# EAGLE design MAIN_BOARD_01 (EAGLE 9.2.2)

## Sheet 1 of 3
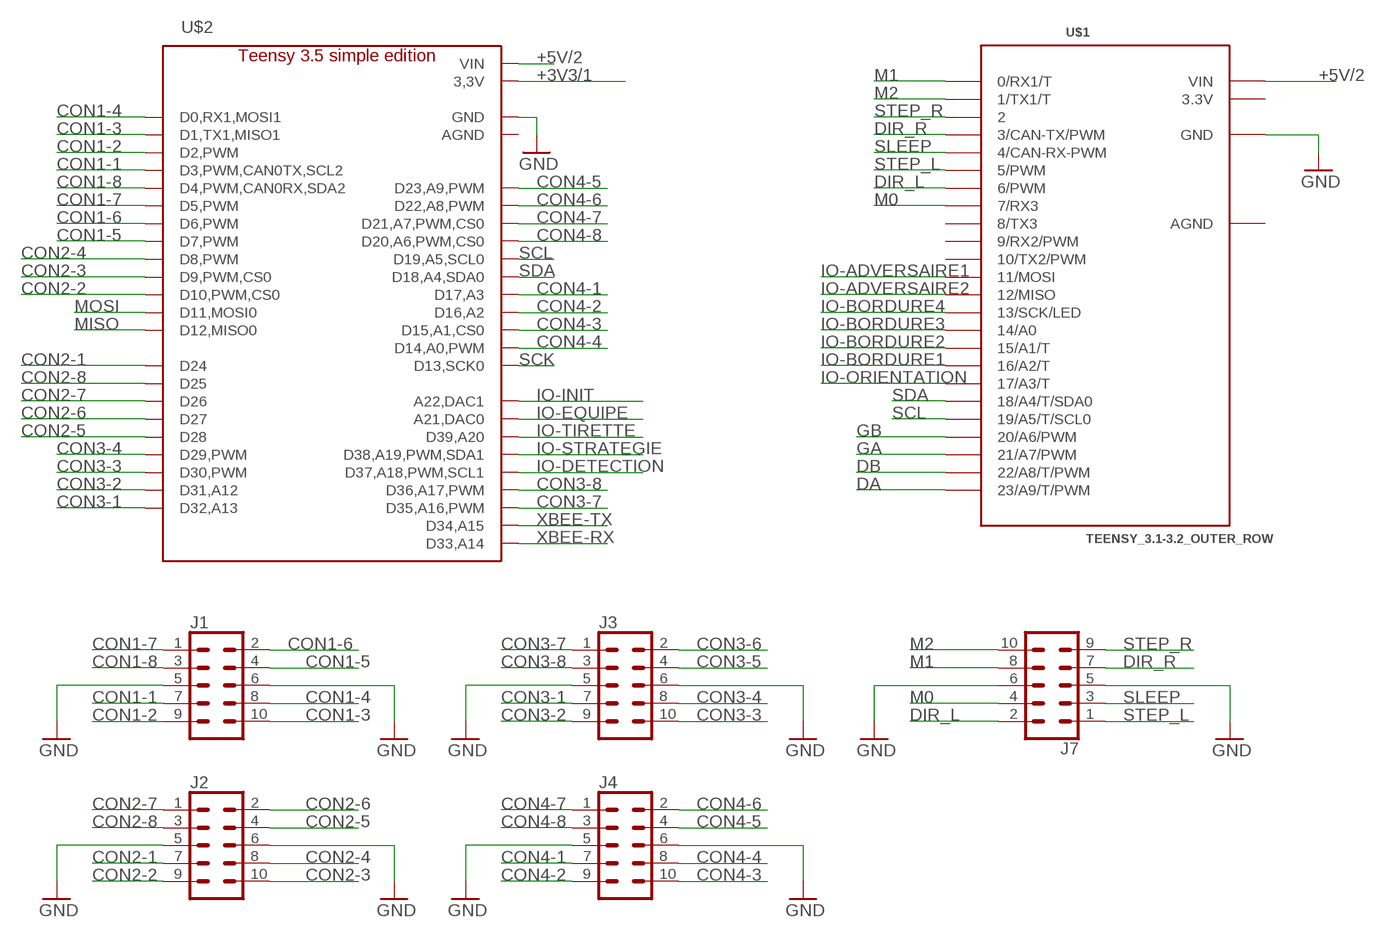
[diagram p0: schematic, sheet 1]

### Parts
J1  CONN_05X2SHD  [2X5-SHROUDED]
J2  CONN_05X2SHD  [2X5-SHROUDED]
J3  CONN_05X2SHD  [2X5-SHROUDED]
J4  CONN_05X2SHD  [2X5-SHROUDED]
J7  CONN_05X2SHD  [2X5-SHROUDED]
U$1  TEENSY_3.1-3.2_OUTER_ROW  [TEENSY_3.0-3.2&LC_OUTER_ROW]
U$2  TEENSY_3.5  [TEENSY_3.5_LIGHT]

### Nets
+3V3/1: U$2.P$15(3,3V) U$2.P$46(3,3V) ; also sheet 2
+5V/2: U$1.V_IN(VIN) U$2.P$48(VIN) ; also sheet 3
CON1-1: J1.7 U$2.P$5(D3,PWM,CAN0TX,SCL2)
CON1-2: J1.9 U$2.P$4(D2,PWM)
CON1-3: J1.10 U$2.P$3(D1,TX1,MISO1)
CON1-4: J1.8 U$2.P$2(D0,RX1,MOSI1)
CON1-5: J1.4 U$2.P$9(D7,PWM)
CON1-6: J1.2 U$2.P$8(D6,PWM)
CON1-7: J1.1 U$2.P$7(D5,PWM)
CON1-8: J1.3 U$2.P$6(D4,PWM,CAN0RX,SDA2)
CON2-1: J2.7 U$2.P$16(D24)
CON2-2: J2.9 U$2.P$12(D10,PWM,CS0)
CON2-3: J2.10 U$2.P$11(D9,PWM,CS0)
CON2-4: J2.8 U$2.P$10(D8,PWM)
CON2-5: J2.4 U$2.P$20(D28)
CON2-6: J2.2 U$2.P$19(D27)
CON2-7: J2.1 U$2.P$18(D26)
CON2-8: J2.3 U$2.P$17(D25)
CON3-1: J3.7 U$2.P$24(D32,A13)
CON3-2: J3.9 U$2.P$23(D31,A12)
CON3-3: J3.10 U$2.P$22(D30,PWM)
CON3-4: J3.8 U$2.P$21(D29,PWM)
CON3-5: J3.4
CON3-6: J3.2
CON3-7: J3.1 U$2.P$27(D35,A16,PWM)
CON3-8: J3.3 U$2.P$28(D36,A17,PWM)
CON4-1: J4.7 U$2.P$39(D17,A3)
CON4-2: J4.9 U$2.P$38(D16,A2)
CON4-3: J4.10 U$2.P$37(D15,A1,CS0)
CON4-4: J4.8 U$2.P$36(D14,A0,PWM)
CON4-5: J4.4 U$2.P$45(D23,A9,PWM)
CON4-6: J4.2 U$2.P$44(D22,A8,PWM)
CON4-7: J4.1 U$2.P$43(D21,A7,PWM,CS0)
CON4-8: J4.3 U$2.P$42(D20,A6,PWM,CS0)
DA: U$1.23/A9(23/A9/T/PWM) ; also sheet 2
DB: U$1.22/A8(22/A8/T/PWM) ; also sheet 2
DIR_L: J7.2 U$1.6(6/PWM)
DIR_R: J7.7 U$1.3(3/CAN-TX/PWM)
GA: U$1.21/A7(21/A7/PWM) ; also sheet 2
GB: U$1.20/A6(20/A6/PWM) ; also sheet 2
GND: J1.5 J1.6 J2.5 J2.6 J3.5 J3.6 J4.5 J4.6 J7.5 J7.6 U$1.GND U$2.GND U$2.P$34(GND) ; also sheet 2,3
IO-ADVERSAIRE1: U$1.11(11/MOSI) ; also sheet 2
IO-ADVERSAIRE2: U$1.12(12/MISO) ; also sheet 2
IO-BORDURE1: U$1.16/A2(16/A2/T) ; also sheet 2
IO-BORDURE2: U$1.15/A1(15/A1/T) ; also sheet 2
IO-BORDURE3: U$1.14/A0 ; also sheet 2
IO-BORDURE4: U$1.13(13/SCK/LED) ; also sheet 2
IO-DETECTION: U$2.P$29(D37,A18,PWM,SCL1) ; also sheet 2
IO-EQUIPE: U$2.P$32(A21,DAC0) ; also sheet 2
IO-INIT: U$2.P$33(A22,DAC1) ; also sheet 2
IO-ORIENTATION: U$1.17/A3(17/A3/T) ; also sheet 2
IO-STRATEGIE: U$2.P$30(D38,A19,PWM,SDA1) ; also sheet 2
IO-TIRETTE: U$2.P$31(D39,A20) ; also sheet 2
M0: J7.4 U$1.7(7/RX3)
M1: J7.8 U$1.0(0/RX1/T)
M2: J7.10 U$1.1(1/TX1/T)
MISO: U$2.P$14(D12,MISO0) ; also sheet 2
MOSI: U$2.P$13(D11,MOSI0) ; also sheet 2
SCK: U$2.P$35(D13,SCK0) ; also sheet 2
SCL: U$1.19/A5(19/A5/T/SCL0) U$2.P$41(D19,A5,SCL0) ; also sheet 2
SDA: U$1.18/A4(18/A4/T/SDA0) U$2.P$40(D18,A4,SDA0) ; also sheet 2
SLEEP: J7.3 U$1.4(4/CAN-RX-PWM)
STEP_L: J7.1 U$1.5(5/PWM)
STEP_R: J7.9 U$1.2
XBEE-RX: U$2.P$25(D33,A14) ; also sheet 2
XBEE-TX: U$2.P$26(D34,A15) ; also sheet 2
Unconnected: U$1.8(8/TX3) U$1.9(9/RX2/PWM) U$1.10(10/TX2/PWM) U$2.P$47(AGND)

## Sheet 2 of 3
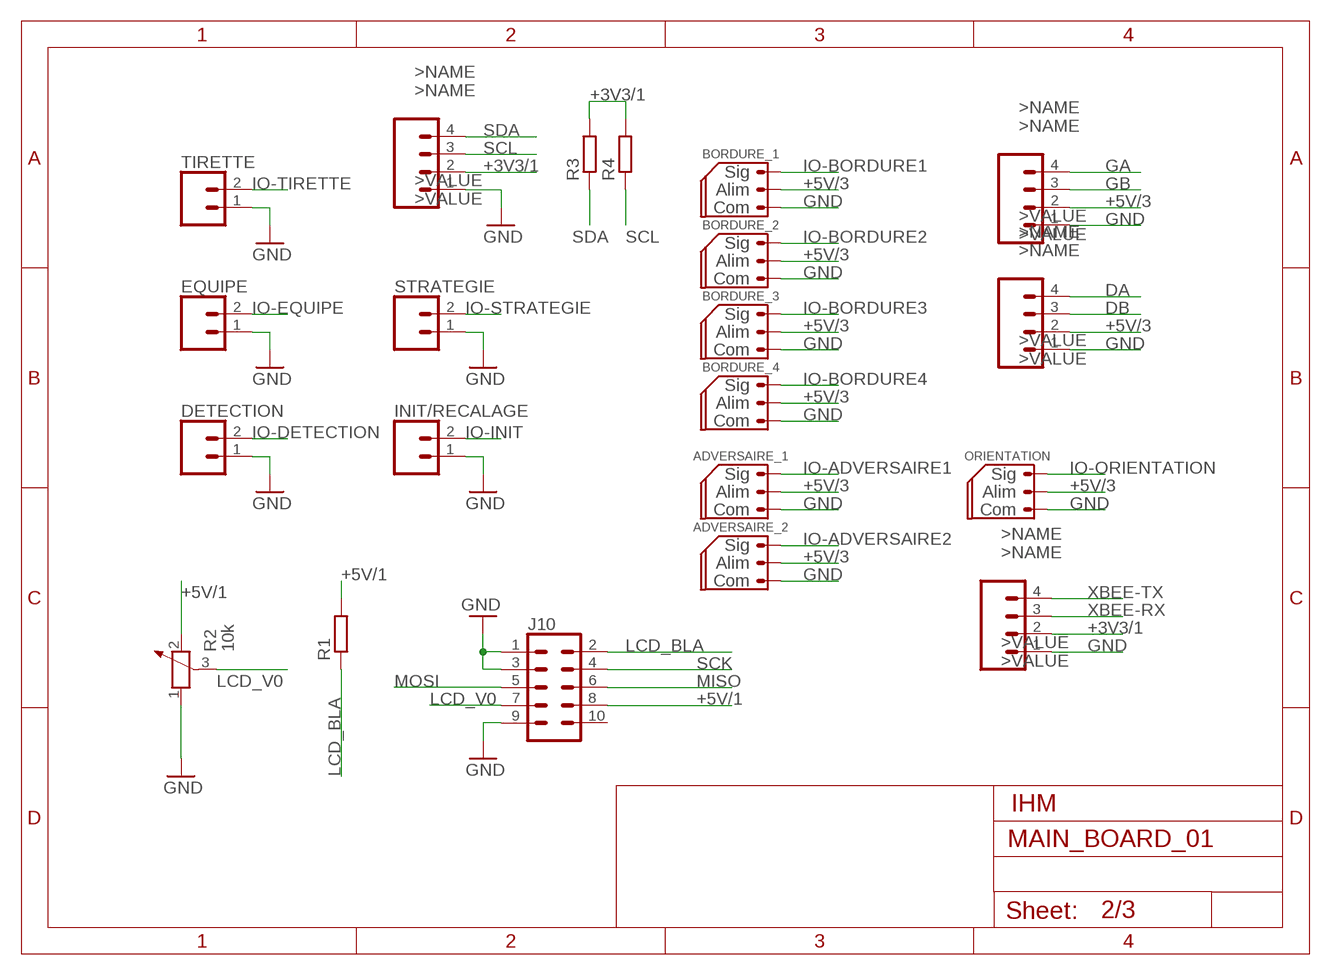
[diagram p1: schematic, sheet 2]

### Parts
ADVERSAIRE_1  CONN_03_SERVO  [MOLEX-1X3]
ADVERSAIRE_2  CONN_03_SERVO  [MOLEX-1X3]
BORDURE_1  CONN_03_SERVO  [MOLEX-1X3]
BORDURE_2  CONN_03_SERVO  [MOLEX-1X3]
BORDURE_3  CONN_03_SERVO  [MOLEX-1X3]
BORDURE_4  CONN_03_SERVO  [MOLEX-1X3]
COM-I2C  CONN_04POLAR  [MOLEX-1X4]
COM-XBEE  CONN_04POLAR  [MOLEX-1X4]
DETECTION  CONN_02POLAR  [MOLEX-1X2]
ENC_DROIT  CONN_04POLAR  [MOLEX-1X4]
ENC_GAUCHE  CONN_04POLAR  [MOLEX-1X4]
EQUIPE  CONN_02POLAR  [MOLEX-1X2]
INIT/RECALAGE  CONN_02POLAR  [MOLEX-1X2]
J10  CONN_05X2SHD  [2X5-SHROUDED]
ORIENTATION  CONN_03_SERVO  [MOLEX-1X3]
R1  R-EU_R1206  [R1206]
R2  10k  POTENTIOMETER_PT-10  [PT-10]
R3  R-EU_R1206  [R1206]
R4  R-EU_R1206  [R1206]
STRATEGIE  CONN_02POLAR  [MOLEX-1X2]
TIRETTE  CONN_02POLAR  [MOLEX-1X2]

### Nets
+3V3/1: COM-I2C.2 COM-XBEE.2 R3.2 R4.2 ; also sheet 1
+5V/1: J10.8 R1.2 R2.2 ; also sheet 3
+5V/3: ADVERSAIRE_1.2 ADVERSAIRE_2.2 BORDURE_1.2 BORDURE_2.2 BORDURE_3.2 BORDURE_4.2 ENC_DROIT.2 ENC_GAUCHE.2 ORIENTATION.2 ; also sheet 3
DA: ENC_DROIT.4 ; also sheet 1
DB: ENC_DROIT.3 ; also sheet 1
GA: ENC_GAUCHE.4 ; also sheet 1
GB: ENC_GAUCHE.3 ; also sheet 1
GND: ADVERSAIRE_1.1 ADVERSAIRE_2.1 BORDURE_1.1 BORDURE_2.1 BORDURE_3.1 BORDURE_4.1 COM-I2C.1 COM-XBEE.1 DETECTION.1 ENC_DROIT.1 ENC_GAUCHE.1 EQUIPE.1 INIT/RECALAGE.1 J10.1 J10.3 J10.9 ORIENTATION.1 R2.1 STRATEGIE.1 TIRETTE.1 ; also sheet 1,3
IO-ADVERSAIRE1: ADVERSAIRE_1.3 ; also sheet 1
IO-ADVERSAIRE2: ADVERSAIRE_2.3 ; also sheet 1
IO-BORDURE1: BORDURE_1.3 ; also sheet 1
IO-BORDURE2: BORDURE_2.3 ; also sheet 1
IO-BORDURE3: BORDURE_3.3 ; also sheet 1
IO-BORDURE4: BORDURE_4.3 ; also sheet 1
IO-DETECTION: DETECTION.2 ; also sheet 1
IO-EQUIPE: EQUIPE.2 ; also sheet 1
IO-INIT: INIT/RECALAGE.2 ; also sheet 1
IO-ORIENTATION: ORIENTATION.3 ; also sheet 1
IO-STRATEGIE: STRATEGIE.2 ; also sheet 1
IO-TIRETTE: TIRETTE.2 ; also sheet 1
LCD_BLA: J10.2 R1.1
LCD_V0: J10.7 R2.3
MISO: J10.6 ; also sheet 1
MOSI: J10.5 ; also sheet 1
SCK: J10.4 ; also sheet 1
SCL: COM-I2C.3 R4.1 ; also sheet 1
SDA: COM-I2C.4 R3.1 ; also sheet 1
XBEE-RX: COM-XBEE.3 ; also sheet 1
XBEE-TX: COM-XBEE.4 ; also sheet 1
Unconnected: J10.10

### Notes on the sheet
- IHM

## Sheet 3 of 3
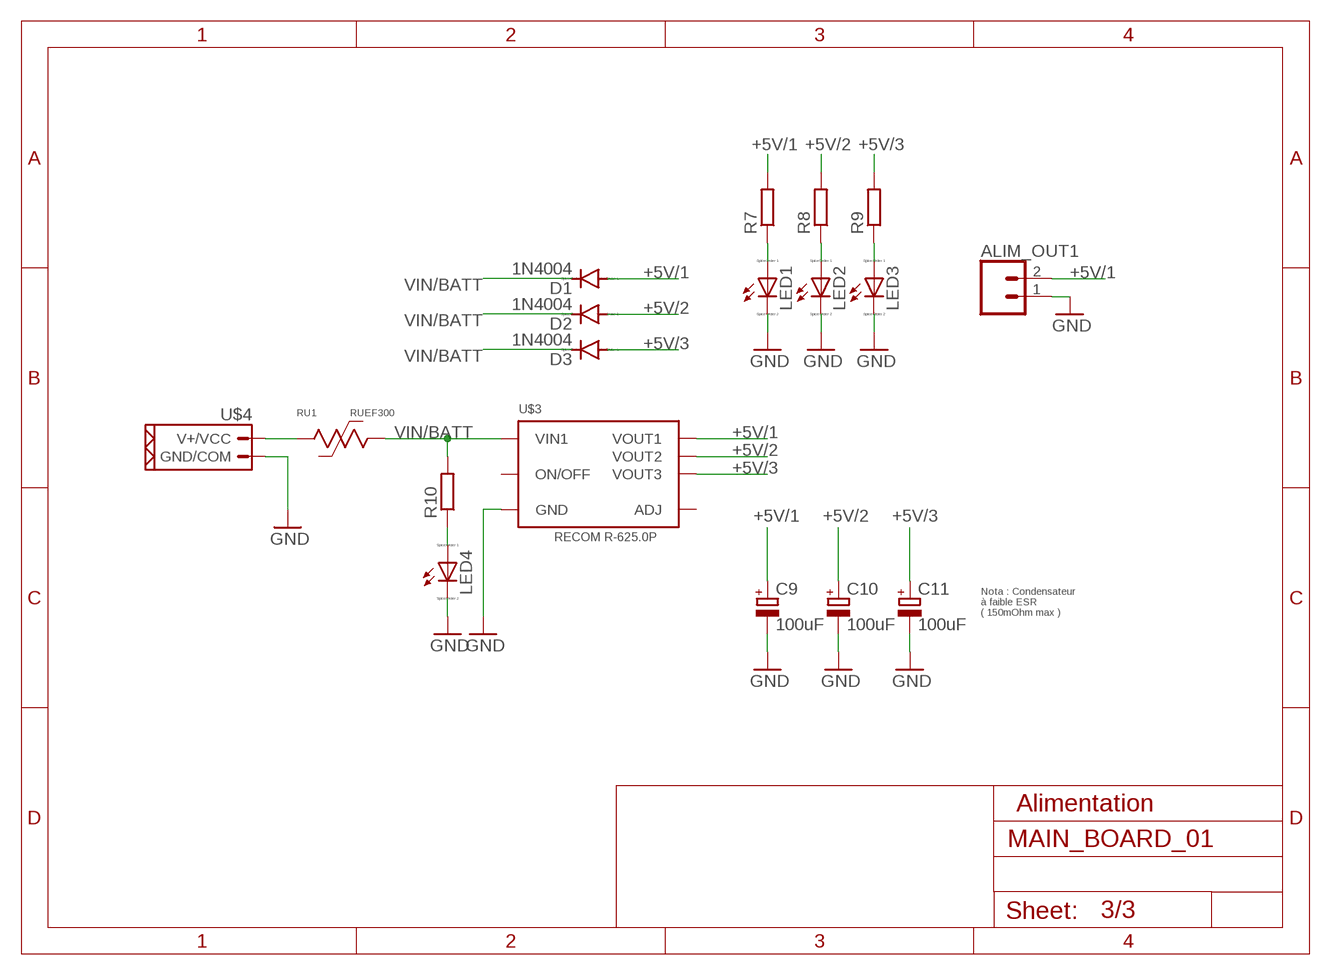
[diagram p2: schematic, sheet 3]

### Parts
ALIM_OUT1  CONN_02POLAR  [MOLEX-1X2]
C9  100uF  CPOL-EUE5-10.5  [E5-10,5]
C10  100uF  CPOL-EUE5-10.5  [E5-10,5]
C11  100uF  CPOL-EUE5-10.5  [E5-10,5]
D1  1N4004  [DO41-10]
D2  1N4004  [DO41-10]
D3  1N4004  [DO41-10]
LED1  LED_E  [LED_1206]
LED2  LED_E  [LED_1206]
LED3  LED_E  [LED_1206]
LED4  LED_E  [LED_1206]
R7  R-EU_R1206  [R1206]
R8  R-EU_R1206  [R1206]
R9  R-EU_R1206  [R1206]
R10  R-EU_R1206  [R1206]
RU1  RUEF300  [RUEF300]
U$3  R-625.0P  [R-6XXXP]
U$4  CONN_02_PUI  [NSK396-2C]

### Nets
+5V/1: ALIM_OUT1.2 C9.+ D1.A R7.2 U$3.P$9(VOUT1) ; also sheet 2
+5V/2: C10.+ D2.A R8.2 U$3.P$10(VOUT2) ; also sheet 1
+5V/3: C11.+ D3.A R9.2 U$3.P$11(VOUT3) ; also sheet 2
GND: ALIM_OUT1.1 C9.- C10.- C11.- LED1.C LED2.C LED3.C LED4.C U$3.P$5(GND) U$3.P$6(GND) U$3.P$7(GND) U$3.P$8(GND) U$4.P$1(GND/COM) ; also sheet 1,2
N$2: LED1.A R7.1
N$3: LED4.A R10.1
N$4: RU1.P$1 U$4.P$2(V+/VCC)
N$5: LED2.A R8.1
N$6: LED3.A R9.1
VIN/BATT: D1.C D2.C D3.C R10.2 RU1.P$2 U$3.P$2(VIN1) U$3.P$3(VIN1) U$3.P$4(VIN1)
Unconnected: U$3.P$1(ON/OFF)

### Notes on the sheet
- Nota : Condensateur
  à faible ESR 
  ( 150mOhm max )
- Alimentation

## Power pins joined to a net without a drawn wire
3.3V: U$1.3.3V
ADJ: U$3.P$12(ADJ)
AGND: U$1.AGND

## Library data of the parts
ADVERSAIRE_1 ADVERSAIRE_2 BORDURE_1-BORDURE_4 ORIENTATION = OPENBOT:CONN_03_SERVO
ALIM_OUT1 DETECTION EQUIPE INIT/RECALAGE STRATEGIE TIRETTE = OPENBOT:CONN_02: Multi connection point. Often used as Generic Header-pin footprint for 0.1 inch spaced/style header connections On any of the 0.1 inch spaced packages, you can populate with these: Break Away Headers - Straight <https://www.sparkfun.com/products/116> (PRT-00116) Break Away Male Headers - Right Angle <https://www.sparkfun.com/products/553> (PRT-00553) Female Headers <https://www.sparkfun.com/products/115> (PRT-00115) Break Away Headers - Machine Pin <https://www.sparkfun.com/products/117> (PRT-00117) Break Away Female Headers - Swiss Machine Pin <https://www.sparkfun.com/products/743> (PRT-00743) For SCREWTERMINALS and SPRING TERMINALS visit here: Screw Terimnals on SparkFun.com <https://www.sparkfun.com/search/results?term=Screw+Terminals> (5mm/3.5mm/2.54mm spacing) This device is also useful as a general connection point to wire up your design to another part of your project. Our various solder wires solder well into these plated through hole pads. Hook-Up Wire - Assortment (Stranded, 22 AWG) <https://www.sparkfun.com/products/11375> (PRT-11375) Hook-Up Wire - Assortment (Solid Core, 22 AWG) <https://www.sparkfun.com/products/11367> (PRT-11367) View the entire wire category on our website here <https://www.sparkfun.com/categories/141> Special notes: Molex polarized connector foot print use with: PRT-08233 with associated crimp pins and housings. 2.54_SCREWTERM for use with PRT-10571. 3.5mm Screw Terminal footprints for PRT-08084 5mm Screw Terminal footprints for use with PRT-08432 Multi connection point. Often used as Generic Header-pin footprint for 0.1 inch spaced/style header connections On any of the 0.1 inch spaced packages, you can populate with these: Break Away Headers - Straight <https://www.sparkfun.com/products/116> (PRT-00116) Break Away Male Headers - Right Angle <https://www.sparkfun.com/products/553> (PRT-00553) Female Headers <https://www.sparkfun.com/products/115> (PRT-00115) Break Away Headers - Machine Pin <https://www.sparkfun.com/products/117> (PRT-00117) Break Away Female Headers - Swiss Machine Pin <https://www.sparkfun.com/products/743> (PRT-00743) For SCREWTERMINALS and SPRING TERMINALS visit here: Screw Terimnals on SparkFun.com <https://www.sparkfun.com/search/results?term=Screw+Terminals> (5mm/3.5mm/2.54mm spacing) This device is also useful as a general connection point to wire up your design to another part of your project. Our various solder wires solder well into these plated through hole pads. Hook-Up Wire - Assortment (Stranded, 22 AWG) <https://www.sparkfun.com/products/11375> (PRT-11375) Hook-Up Wire - Assortment (Solid Core, 22 AWG) <https://www.sparkfun.com/products/11367> (PRT-11367) View the entire wire category on our website here <https://www.sparkfun.com/categories/141> Special notes: Molex polarized connector foot print use with: PRT-08233 with associated crimp pins and housings. 2.54_SCREWTERM for use with PRT-10571. 3.5mm Screw Terminal footprints for PRT-08084 5mm Screw Terminal footprints for use with PRT-08432; SF_ID: PRT-09918
C9-C11 = rcl:CPOL-EU: POLARIZED CAPACITOR, European symbol; SPICEPREFIX: C
COM-I2C COM-XBEE ENC_DROIT ENC_GAUCHE = OPENBOT:CONN_04: Multi connection point. Often used as Generic Header-pin footprint for 0.1 inch spaced/style header connections On any of the 0.1 inch spaced packages, you can populate with these: Break Away Headers - Straight <https://www.sparkfun.com/products/116> (PRT-00116) Break Away Male Headers - Right Angle <https://www.sparkfun.com/products/553> (PRT-00553) Female Headers <https://www.sparkfun.com/products/115> (PRT-00115) Break Away Headers - Machine Pin <https://www.sparkfun.com/products/117> (PRT-00117) Break Away Female Headers - Swiss Machine Pin <https://www.sparkfun.com/products/743> (PRT-00743) For SCREWTERMINALS and SPRING TERMINALS visit here: Screw Terimnals on SparkFun.com <https://www.sparkfun.com/search/results?term=Screw+Terminals> (5mm/3.5mm/2.54mm spacing) This device is also useful as a general connection point to wire up your design to another part of your project. Our various solder wires solder well into these plated through hole pads. Hook-Up Wire - Assortment (Stranded, 22 AWG) <https://www.sparkfun.com/products/11375> (PRT-11375) Hook-Up Wire - Assortment (Solid Core, 22 AWG) <https://www.sparkfun.com/products/11367> (PRT-11367) View the entire wire category on our website here <https://www.sparkfun.com/categories/141> Special notes: Molex polarized connector foot print use with SKU : PRT-08231 with associated crimp pins and housings. 1MM SMD Version SKU: PRT-10208 Multi connection point. Often used as Generic Header-pin footprint for 0.1 inch spaced/style header connections On any of the 0.1 inch spaced packages, you can populate with these: Break Away Headers - Straight <https://www.sparkfun.com/products/116> (PRT-00116) Break Away Male Headers - Right Angle <https://www.sparkfun.com/products/553> (PRT-00553) Female Headers <https://www.sparkfun.com/products/115> (PRT-00115) Break Away Headers - Machine Pin <https://www.sparkfun.com/products/117> (PRT-00117) Break Away Female Headers - Swiss Machine Pin <https://www.sparkfun.com/products/743> (PRT-00743) For SCREWTERMINALS and SPRING TERMINALS visit here: Screw Terimnals on SparkFun.com <https://www.sparkfun.com/search/results?term=Screw+Terminals> (5mm/3.5mm/2.54mm spacing) This device is also useful as a general connection point to wire up your design to another part of your project. Our various solder wires solder well into these plated through hole pads. Hook-Up Wire - Assortment (Stranded, 22 AWG) <https://www.sparkfun.com/products/11375> (PRT-11375) Hook-Up Wire - Assortment (Solid Core, 22 AWG) <https://www.sparkfun.com/products/11367> (PRT-11367) View the entire wire category on our website here <https://www.sparkfun.com/categories/141> Special notes: Molex polarized connector foot print use with SKU : PRT-08231 with associated crimp pins and housings. 1MM SMD Version SKU: PRT-10208; PROD_ID: CONN-08186; SF_ID: PRT-08231
D1-D3 = diode:1N4004: DIODE general purpose rectifier, 1 A
J1-J4 J7 J10 = OPENBOT:CONN_05X2: Multi connection point. Often used as Generic Header-pin footprint for 0.1 inch spaced/style header connections For AVR SPI programming port, see special device with nice symbol: "AVR_SPI_PROG_5x2.dev" You can populate with any combo of single row headers, but if you'd like an exact match, check these: 2x5 AVR ICSP Male Header <https://www.sparkfun.com/products/778> (PRT-00778) 2x5 Pin Shrouded Header <https://www.sparkfun.com/products/8506> (PRT-08506) On any of the 0.1 inch spaced packages, you can populate with these: Break Away Headers - Straight <https://www.sparkfun.com/products/116> (PRT-00116) Break Away Male Headers - Right Angle <https://www.sparkfun.com/products/553> (PRT-00553) Female Headers <https://www.sparkfun.com/products/115> (PRT-00115) Break Away Headers - Machine Pin <https://www.sparkfun.com/products/117> (PRT-00117) Break Away Female Headers - Swiss Machine Pin <https://www.sparkfun.com/products/743> (PRT-00743) Special note: the shrouded connector mates well with our 5x2 ribbon cables: 2x5 Pin IDC Ribbon Cable <https://www.sparkfun.com/products/8535> (PRT-08535); PROD_ID: CONN-08671; SF_ID: PRT-08506
LED1-LED4 = eagle-ltspice:LED_E: LED Source: http://www.osram.convergy.de Source: www.luxeon.com Source: www.kingbright.com; SPICEMODEL: NONE; SPICEPREFIX: D; SPICETYPE: diode
R1 R3 R4 R7-R10 = rcl:R-EU_: RESISTOR, European symbol; SPICEPREFIX: R
R2 = rcl:POTENTIOMETER_: Potentiometer
RU1 = OPENBOT:RUEF300
U$1 = OPENBOT:TEENSY_3.1-3.2_OUTER_ROW: Footprint for Teensy 3.1 or 3.2 board using all pin connections on the outer perimeter
U$2 = KARIBOUS:TEENSY_3.5
U$3 = KARIBOUS:R-625.0P
U$4 = OPENBOT:CONN_02_PUI

## Board
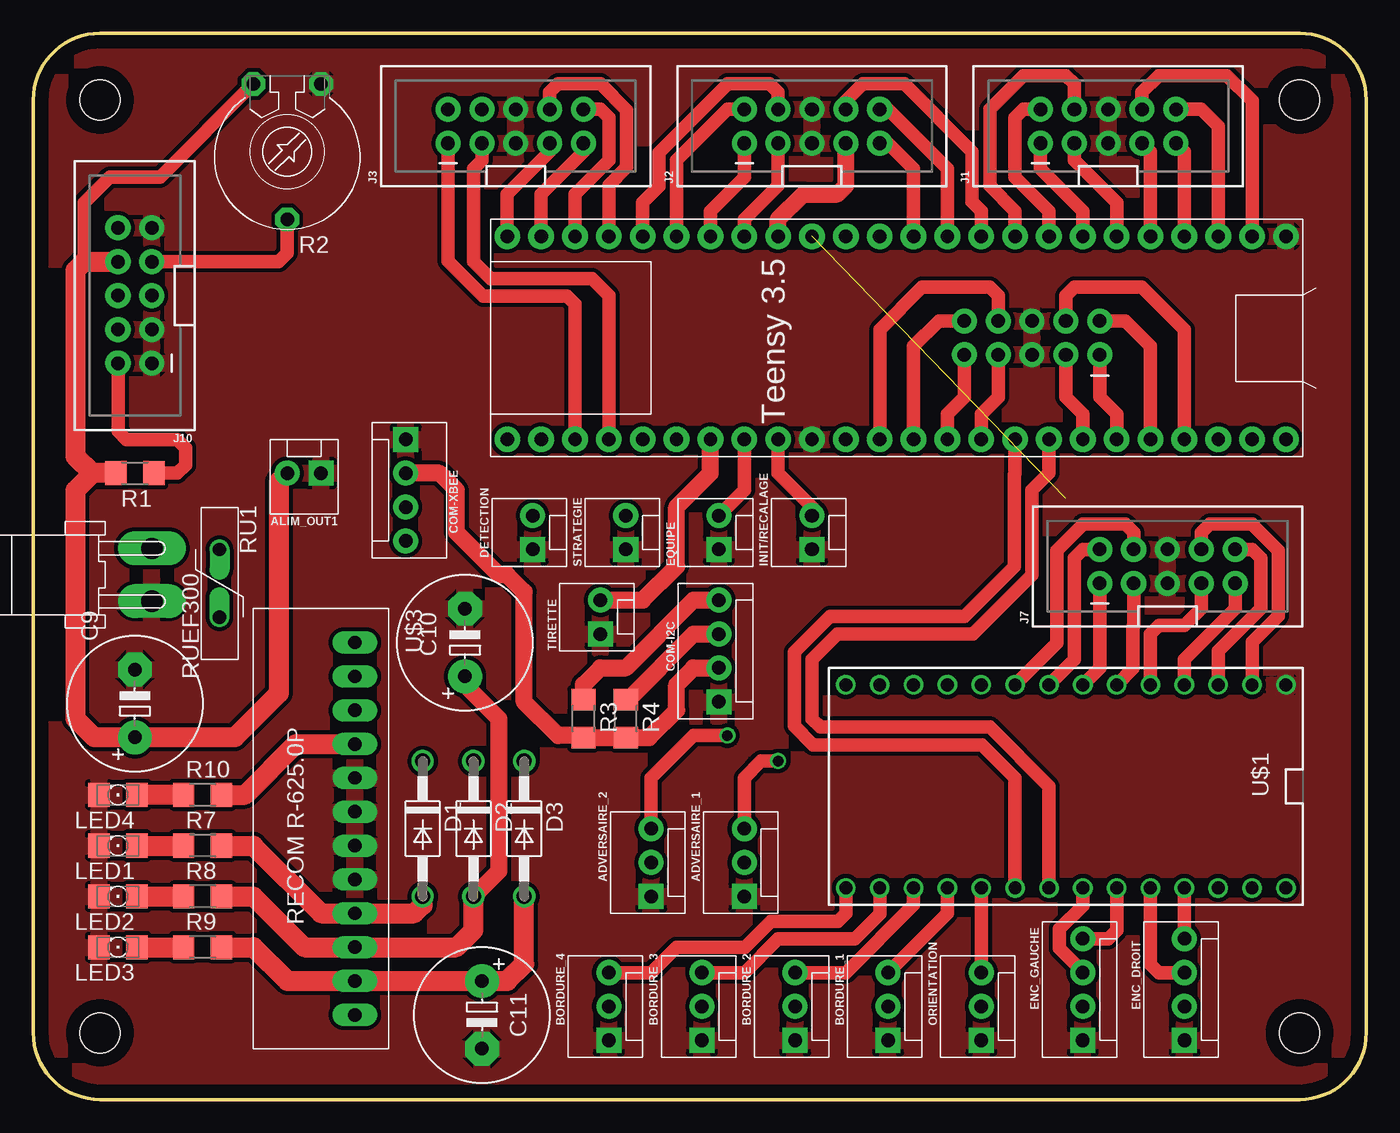
[diagram p3: board, top side]
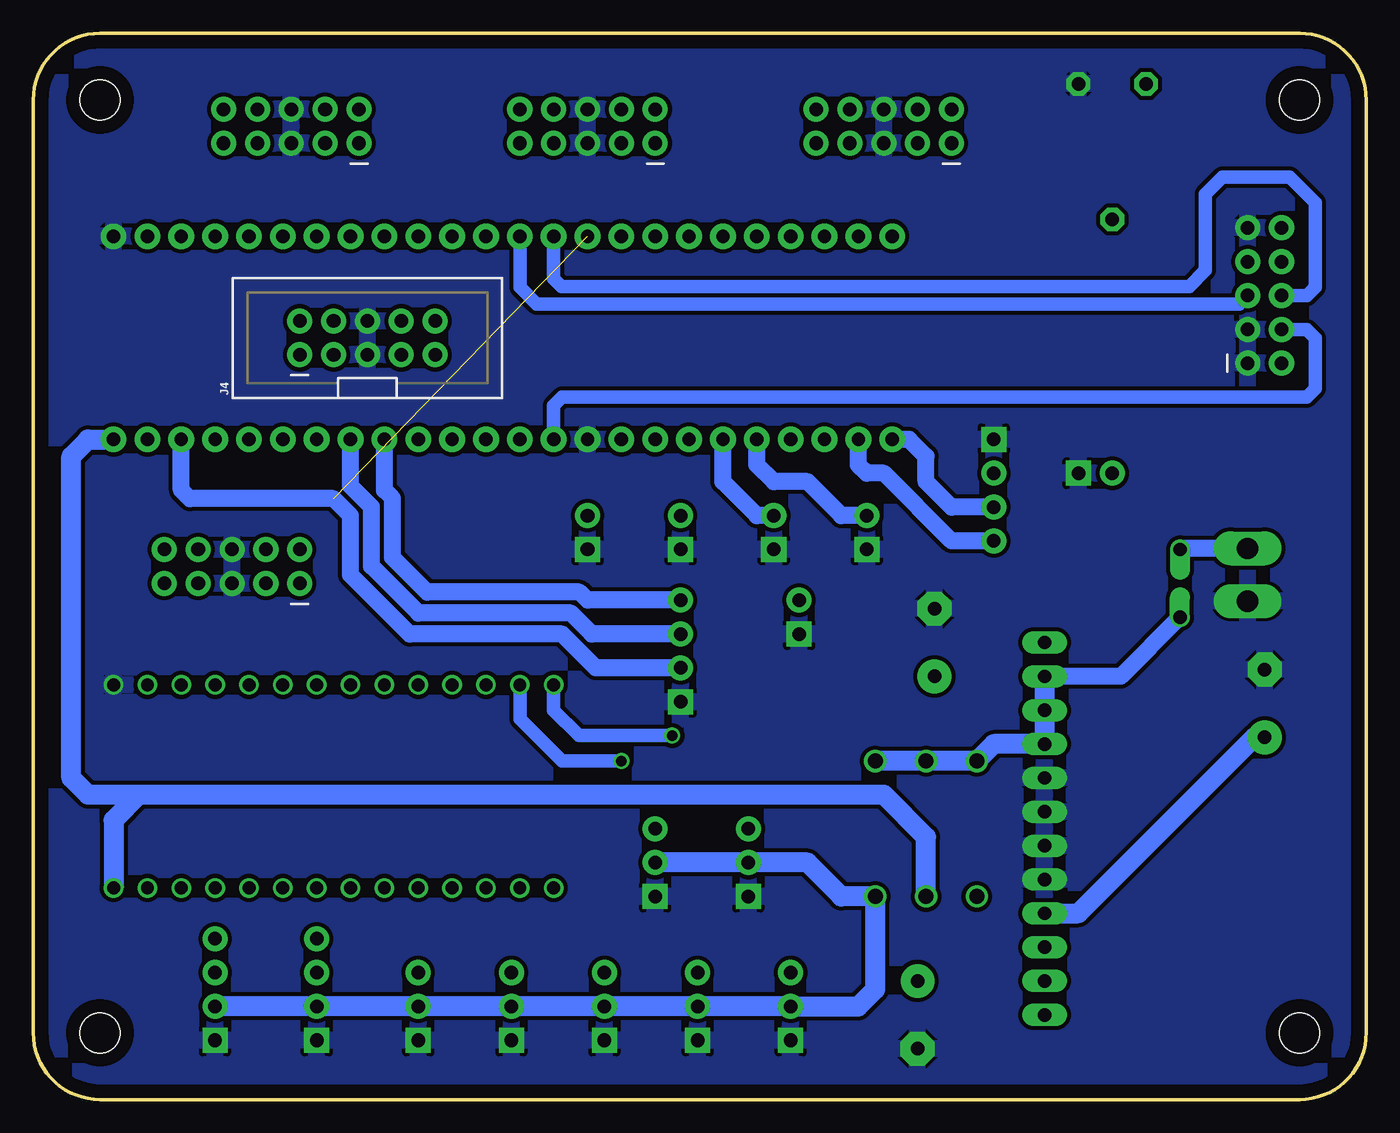
[diagram p4: board, bottom side, seen from below]

Size 100 x 80 mm. Coordinates in mm from the lower left corner, seen from the top.
Outline: 95,0 arc90 100,5 100,75 arc90 95,80 5,80 arc90 0,75 0,5 arc90 5,0 95,0
Copper layers (1*16): Top 0.035mm / dielectric 1.5mm / Bottom 0.035mm
Design rules "default *": minimum track width 6mil, minimum drill 0.35mm, track to track 12mil, track to pad 12mil, pad to pad 6mil, via to via 6mil, smd to smd 6mil, copper to edge 40mil, drill to drill 6mil, minimum pad ring 10mil, minimum via ring 8mil, stop-mask expansion 4mil, vias tented up to drill 0mil, thermal gap 10mil
Holes 3 mm at 95,75 95,5 5,75 5,5

### Footprints (pad centres in the part's own frame; a part is rotated, then mirrored left to right if it is on the bottom)
MOLEX-1X3 = drill 1.016 pad 1.88 square: 1 0,0 | drill 1.016 pad 1.88: 2 2.54,0; 3 5.08,0
MOLEX-1X2 = drill 1.016 pad 1.88 square: 1 0,0 | drill 1.016 pad 1.88: 2 2.54,0
E5-10,5 = drill 1.016 pad 2.54: + -2.54,0 | drill 1.016 pad 2.54 octagon: - 2.54,0
MOLEX-1X4 = drill 1.016 pad 1.88 square: 1 0,0 | drill 1.016 pad 1.88: 2 2.54,0; 3 5.08,0; 4 7.62,0
DO41-10 = drill 1.118: A 5.08,0; C -5.08,0
2X5-SHROUDED = drill 1.016 pad 1.88: 1 -1.27,5.08; 2 1.27,5.08; 3 -1.27,2.54; 4 1.27,2.54; 5 -1.27,0; 6 1.27,0; 7 -1.27,-2.54; 8 1.27,-2.54; 9 -1.27,-5.08; 10 1.27,-5.08
LED_1206 = smd 1.6 x 1.803: A -1.422,0; C 1.422,0
R1206 = smd 1.6 x 1.803: 1 -1.422,0; 2 1.422,0
PT-10 = drill 1.016 pad 1.778 octagon: 1 -2.54,-5.08; 2 2.54,-5.08; 3 0,5.08
RUEF300 = drill 1 offset: P$1 -2.54,0; P$2 2.54,0
TEENSY_3.0-3.2&LC_OUTER_ROW = drill 0.965: 0 -7.62,13.97; 1 -7.62,11.43; 2 -7.62,8.89; 3 -7.62,6.35; 3.3V 7.62,11.43; 4 -7.62,3.81; 5 -7.62,1.27; 6 -7.62,-1.27; 7 -7.62,-3.81; 8 -7.62,-6.35; 9 -7.62,-8.89; 10 -7.62,-11.43; 11 -7.62,-13.97; 12 -7.62,-16.51; 13 7.62,-16.51; 14/A0 7.62,-13.97; 15/A1 7.62,-11.43; 16/A2 7.62,-8.89; 17/A3 7.62,-6.35; 18/A4 7.62,-3.81; 19/A5 7.62,-1.27; 20/A6 7.62,1.27; 21/A7 7.62,3.81; 22/A8 7.62,6.35; 23/A9 7.62,8.89; AGND 7.62,13.97; GND -7.62,16.51; V_IN 7.62,16.51
TEENSY_3.5_LIGHT = drill 1 pad 1.93: GND -7.62,0; P$2 -7.62,-2.54; P$3 -7.62,-5.08; P$4 -7.62,-7.62; P$5 -7.62,-10.16; P$6 -7.62,-12.7; P$7 -7.62,-15.24; P$8 -7.62,-17.78; P$9 -7.62,-20.32; P$10 -7.62,-22.86; P$11 -7.62,-25.4; P$12 -7.62,-27.94; P$13 -7.62,-30.48; P$14 -7.62,-33.02; P$15 -7.62,-35.56; P$16 -7.62,-38.1; P$17 -7.62,-40.64; P$18 -7.62,-43.18; P$19 -7.62,-45.72; P$20 -7.62,-48.26; P$21 -7.62,-50.8; P$22 -7.62,-53.34; P$23 -7.62,-55.88; P$24 -7.62,-58.42; P$25 7.62,-58.42; P$26 7.62,-55.88; P$27 7.62,-53.34; P$28 7.62,-50.8; P$29 7.62,-48.26; P$30 7.62,-45.72; P$31 7.62,-43.18; P$32 7.62,-40.64; P$33 7.62,-38.1; P$34 7.62,-35.56; P$35 7.62,-33.02; P$36 7.62,-30.48; P$37 7.62,-27.94; P$38 7.62,-25.4; P$39 7.62,-22.86; P$40 7.62,-20.32; P$41 7.62,-17.78; P$42 7.62,-15.24; P$43 7.62,-12.7; P$44 7.62,-10.16; P$45 7.62,-7.62; P$46 7.62,-5.08; P$47 7.62,-2.54; P$48 7.62,0
R-6XXXP = drill 1 pad 1.676 long: P$1 0,0; P$2 2.54,0; P$3 5.08,0; P$4 7.62,0; P$5 10.16,0; P$6 12.7,0; P$7 15.24,0; P$8 17.78,0; P$9 20.32,0; P$10 22.86,0; P$11 25.4,0; P$12 27.94,0
NSK396-2C = drill 1.6 pad 2.54 long: P$1 -1.98,0; P$2 1.98,0

### Placement (x,y rotation side)
ADVERSAIRE_1  53.34,15.24 90 top
ADVERSAIRE_2  46.35,15.24 90 top
ALIM_OUT1  21.59,46.99 180 top
BORDURE_1  64.14,4.45 90 top
BORDURE_2  57.15,4.45 90 top
BORDURE_3  50.16,4.45 90 top
BORDURE_4  43.18,4.45 90 top
C9  7.62,29.72 90 top
C10  32.38,34.29 90 top
C11  33.66,6.35 270 top
COM-I2C  51.44,29.84 90 top
COM-XBEE  27.94,49.53 270 top
D1  29.21,20.32 270 top
D2  33.02,20.32 270 top
D3  36.83,20.32 270 top
DETECTION  37.47,41.27 90 top
ENC_DROIT  86.36,4.45 90 top
ENC_GAUCHE  78.74,4.45 90 top
EQUIPE  51.44,41.27 90 top
INIT/RECALAGE  58.42,41.27 90 top
J1  80.64,73.03 90 top
J2  58.42,73.03 90 top
J3  36.2,73.03 90 top
J4  74.93,57.15 90 bottom
J7  85.09,40.01 90 top
J10  7.62,60.33 180 top
LED1  6.35,19.05 180 top
LED2  6.35,15.24 180 top
LED3  6.35,11.43 180 top
LED4  6.35,22.86 180 top
ORIENTATION  71.12,4.45 90 top
R1  7.62,46.99 180 top
R2  19.05,71.12 180 top
R3  41.27,28.57 270 top
R4  44.45,28.57 270 top
R7  12.7,19.05 0 top
R8  12.7,15.24 0 top
R9  12.7,11.43 0 top
R10  12.7,22.86 0 top
RU1  13.97,38.73 270 top
STRATEGIE  44.45,41.27 90 top
TIRETTE  42.55,34.92 90 top
U$1  77.47,23.5 270 top
U$2  93.98,57.15 270 top
U$3  24.13,34.29 270 top
U$4  8.89,39.37 90 top

### Tracks (layer width: path | path; a pad name or v marks a point on that pad's centre or on a via)
+3V3/1  (1 unrouted)
  Top 1.27: COM-I2C.2 49.53,32.38 48.26,31.11 48.26,29.21 46.2,27.15 R4.2 R3.2 41.12,27.3 39.37,27.3 36.83,29.84 36.83,38.1 35.56,39.37 34.92,39.37 31.75,42.55 31.75,45.72 30.48,46.99 COM-XBEE.2
  Bottom 1.27: COM-I2C.2 57.78,32.38 60.33,34.92 71.75,34.92 76.2,39.37 76.2,43.81 77.47,45.09 88.27,45.09 88.9,45.72 U$2.P$46
+5V/1
  Top 1.016: R2.2 9.53,69.22 5.71,69.22 3.81,67.31 3.81,62.87
  Top 1.5: R7.2 16.51,19.05 21.59,13.97 U$3.P$9 28.57,13.97 29.21,14.61 D1.A | 4.45,46.99 3.17,45.72 3.17,28.57 4.57,27.18 C9.+ 15.11,27.18 18.41,30.48 18.41,46.35 ALIM_OUT1.2 | R1.2 4.45,46.99 | 4.45,46.99 3.17,48.26 3.17,62.23 3.81,62.87 J10.8
  Bottom 1.5: U$3.P$9 21.59,13.97 8.38,27.18 C9.+
+5V/2
  Top 1.27: D2.A 34.92,17.14 34.92,28.57 32.38,31.11 C10.+
  Top 1.5: R8.2 16.51,15.24 20.32,11.43 U$3.P$10 31.75,11.43 33.02,12.7 D2.A
  Bottom 1.5: D2.A 33.02,19.68 36.2,22.86 92.08,22.86 | 92.08,22.86 93.98,20.95 U$1.V_IN | 92.08,22.86 95.89,22.86 97.16,24.13 97.16,48.26 95.89,49.53 U$2.P$48
+5V/3
  Top 1.5: R9.2 16.51,11.43 19.05,8.89 U$3.P$11 C11.+ 35.56,8.89 36.83,10.16 D3.A
  Bottom 1.5: ENC_DROIT.2 ENC_GAUCHE.2 ORIENTATION.2 BORDURE_1.2 BORDURE_2.2 BORDURE_3.2 BORDURE_4.2 38.1,6.99 36.83,8.26 D3.A 39.37,15.24 41.91,17.78 ADVERSAIRE_2.2 ADVERSAIRE_1.2
CON1-1
  Top 1.016: J1.7 83.82,71.12 U$2.P$5
CON1-2
  Top 1.016: J1.9 86.36,71.12 U$2.P$4
CON1-3
  Top 1.016: U$2.P$3 88.9,73.03 87.63,74.3 J1.10
CON1-4
  Top 1.016: U$2.P$2 91.44,74.93 89.53,76.83 84.45,76.83 83.19,75.56 J1.8
CON1-5
  Top 1.016: U$2.P$9 73.66,66.67 71.75,68.58 71.75,74.3 74.3,76.83 77.47,76.83 78.11,76.2 J1.4
CON1-6
  Top 1.016: U$2.P$8 76.2,66.67 73.66,69.22 73.66,73.66 74.3,74.3 J1.2
CON1-7
  Top 1.016: U$2.P$7 78.74,66.67 75.56,69.85 J1.1
CON1-8
  Top 1.016: U$2.P$6 81.28,67.31 78.11,70.48 J1.3
CON2-1
  Top 1.27: U$2.P$16 55.88,66.04 57.78,67.94 60.33,67.94 60.96,68.58 J2.7
CON2-2
  Top 1.016: U$2.P$12 66.04,69.85 64.14,71.75 J2.9
CON2-3
  Top 1.016: U$2.P$11 68.58,69.85 64.14,74.3 J2.10
CON2-4
  Top 1.016: J2.8 60.96,74.93 62.23,76.2 65.35,76.2 70.43,71.12 70.43,67.36 71.12,66.67 U$2.P$10
CON2-5
  Top 1.016: J2.4 55.88,75.56 55.24,76.2 52.07,76.2 52.07,76.16 46.94,71.03 46.94,68.53 45.72,67.31 U$2.P$20
CON2-6
  Top 1.016: J2.2 52.07,74.3 48.26,70.48 U$2.P$19
CON2-7
  Top 1.016: U$2.P$18 50.8,66.67 53.34,69.22 J2.1
CON2-8
  Top 1.016: U$2.P$17 53.34,66.04 55.88,68.58 J2.3
CON3-1
  Top 1.016: U$2.P$24 35.56,67.94 38.73,71.12 J3.7
CON3-2
  Top 1.016: U$2.P$23 38.1,67.94 41.27,71.12 J3.9
CON3-3
  Top 1.016: U$2.P$22 40.64,67.94 43.18,70.48 43.18,73.66 42.55,74.3 J3.10
CON3-4
  Top 1.016: U$2.P$21 43.18,68.62 44.5,69.94 44.5,74.24 42.55,76.2 39.37,76.2 38.73,75.56 J3.8
CON3-7
  Top 1.016: U$2.P$27 40.64,59.69 40.06,60.27 33.74,60.27 31.11,62.9 J3.1
CON3-8
  Top 1.016: U$2.P$28 43.18,60.33 41.91,61.59 34.29,61.59 33.02,62.87 33.02,69.85 33.66,70.48 J3.3
CON4-1
  Top 1.016: J4.7 72.39,52.7 71.12,51.44 U$2.P$39
CON4-2
  Top 1.016: J4.9 69.85,52.7 68.58,51.44 U$2.P$38
CON4-3
  Top 1.016: U$2.P$37 66.04,56.52 67.94,58.42 J4.10
CON4-4
  Top 1.016: U$2.P$36 63.5,57.78 66.67,60.96 71.75,60.96 72.39,60.33 J4.8
CON4-5
  Top 1.016: U$2.P$45 86.36,57.78 83.19,60.96 78.11,60.96 77.47,60.33 J4.4
CON4-6
  Top 1.016: U$2.P$44 83.82,56.52 81.92,58.42 J4.2
CON4-7
  Top 1.016: J4.1 80.01,52.7 81.28,51.44 U$2.P$43
CON4-8
  Top 1.016: J4.3 77.47,52.7 78.74,51.44 U$2.P$42
DA
  Top 1.016: U$1.23/A9 ENC_DROIT.4
DB
  Top 1.016: U$1.22/A8 83.82,10.16 84.45,9.53 ENC_DROIT.3
DIR_L
  Top 1.016: U$1.6 78.11,33.02 78.11,40.64 78.74,41.27 J7.2
DIR_R
  Top 1.016: J7.7 87.63,36.83 86.36,35.56 84.45,35.56 83.82,34.92 U$1.3
GA
  Top 1.016: U$1.21/A7 81.28,12.7 80.64,12.06 ENC_GAUCHE.4
GB
  Top 1.016: ENC_GAUCHE.3 78.74,9.59 76.99,11.34 76.99,12.79 78.74,14.54 U$1.20/A6
GND
  pour Top: -1.27,81.28 102.23,81.28 102.23,-1.27 -1.27,-1.27
  pour Bottom: -1.27,81.28 102.23,81.28 102.23,-1.91 -1.27,-1.91
IO-ADVERSAIRE1  (via drill 0.8)
  Top 1.016: ADVERSAIRE_1.3 53.34,24.13 54.61,25.4 v55.88,25.4
  Bottom 1.016: v55.88,25.4 60.33,25.4 63.5,28.57 U$1.11
IO-ADVERSAIRE2  (via drill 0.8)
  Top 1.016: ADVERSAIRE_2.3 46.35,24.13 49.53,27.3 v52.07,27.3
  Bottom 1.016: v52.07,27.3 59.05,27.3 60.96,29.21 U$1.12
IO-BORDURE1
  Top 1.016: BORDURE_1.3 68.58,13.97 U$1.16/A2
IO-BORDURE2
  Top 1.016: BORDURE_2.3 60.96,9.53 66.04,14.61 U$1.15/A1
IO-BORDURE3
  Top 1.016: BORDURE_3.3 53.34,9.53 55.88,12.06 61.63,12.06 63.5,13.93 U$1.14/A0
IO-BORDURE4
  Top 1.016: BORDURE_4.3 46.35,9.53 48.26,11.43 53.38,11.43 55.33,13.39 60.38,13.39 60.96,13.97 U$1.13
IO-DETECTION
  Bottom 1.27: DETECTION.2 39.37,43.81 41.91,46.35 44.45,46.35 45.72,47.62 U$2.P$29
IO-EQUIPE
  Top 1.016: U$2.P$32 53.34,45.72 EQUIPE.2
IO-INIT
  Top 1.016: INIT/RECALAGE.2 58.42,44.45 55.88,46.99 U$2.P$33
IO-ORIENTATION
  Top 1.016: ORIENTATION.3 U$1.17/A3
IO-STRATEGIE
  Bottom 1.27: STRATEGIE.2 45.72,43.81 48.26,46.35 U$2.P$30
IO-TIRETTE
  Top 1.27: U$2.P$31 50.8,46.99 48.26,44.45 48.26,40.01 45.72,37.47 TIRETTE.2
LCD_BLA
  Top 1.016: J10.2 6.35,50.16 6.99,49.53 10.79,49.53 11.43,48.9 11.43,47.62 10.79,46.99 R1.1
LCD_V0
  Top 1.016: J10.7 18.41,62.87 19.05,63.5 R2.3
M0
  Top 1.016: U$1.7 76.78,34.24 76.78,41.19 78.74,43.14 78.74,43.18 81.92,43.18 82.55,42.55 J7.4
M1
  Top 1.016: U$1.0 91.44,34.33 93.4,36.28 93.4,41.19 91.44,43.14 91.44,43.18 88.27,43.18 87.63,42.55 J7.8
M2
  Top 1.016: J7.10 91.44,41.27 92.08,40.64 92.08,36.83 88.9,33.66 U$1.1
MISO
  Bottom 1.016: U$2.P$14 60.96,61.59 60.38,61.01 13.28,61.01 12.06,62.23 12.06,67.94 10.79,69.22 5.71,69.22 3.81,67.31 3.81,60.96 4.45,60.33 J10.6
MOSI
  Bottom 1.016: U$2.P$13 63.5,60.96 62.23,59.69 9.53,59.69 J10.5
N$2
  Top 1.5: LED1.A R7.1
N$3
  Top 1.5: R10.1 LED4.A
N$4
  Bottom 1.27: U$4.P$2 13.89,41.35 RU1.P$1
N$5
  Top 1.5: LED2.A R8.1
N$6
  Top 1.5: LED3.A R9.1
SCK
  Bottom 1.016: U$2.P$35 60.96,52.07 60.33,52.7 4.45,52.7 3.81,53.34 3.81,57.15 4.45,57.78 J10.4
SCL
  Top 1.016: U$1.19/A5 76.2,23.5 71.75,27.94 59.05,27.94 58.42,28.57 58.42,33.02 60.33,34.92 70.48,34.92 74.93,39.37 74.93,45.72 76.2,46.99 U$2.P$41
  Top 1.27: R4.1 44.6,30 49.53,34.92 COM-I2C.3
  Bottom 1.27: COM-I2C.3 58.1,34.92 59.67,36.5 71.1,36.5 74.62,40.02 74.62,44.47 76.2,46.04 U$2.P$41
SDA
  Top 1.016: U$1.18/A4 73.66,24.13 71.17,26.62 58.51,26.62 57.1,28.03 57.1,33.57 59.78,36.25 69.85,36.25 73.61,40.01 73.61,46.9 73.66,46.95 U$2.P$40
  Top 1.27: R3.1 41.27,31.11 42.55,32.38 44.45,32.38 49.53,37.47 COM-I2C.4
  Bottom 1.27: COM-I2C.4 58.41,37.47 59.02,38.08 70.45,38.08 73.05,40.67 73.05,45.12 73.66,45.73 U$2.P$40
SLEEP
  Top 1.016: U$1.4 82.5,32.33 82.5,35.47 82.55,35.52 J7.3
STEP_L
  Top 1.016: U$1.5 80.01,32.38 J7.1
STEP_R
  Top 1.016: U$1.2 86.36,33.02 90.17,36.83 J7.9
VIN/BATT
  Top 1.5: R10.2 15.88,22.86 19.68,26.67 U$3.P$4
  Bottom 1.27: RU1.P$2 18.41,31.75 U$3.P$2
  Bottom 1.5: U$3.P$2 U$3.P$3 U$3.P$4 27.94,26.67 D1.C D2.C D3.C
XBEE-RX
  Bottom 1.27: COM-XBEE.3 31.11,44.45 33.02,46.35 33.02,48.26 34.29,49.53 U$2.P$25
XBEE-TX
  Bottom 1.27: COM-XBEE.4 31.11,41.91 36.2,46.99 37.47,46.99 38.1,47.62 U$2.P$26